# EAGLE design M715X (EAGLE 6.6.0)
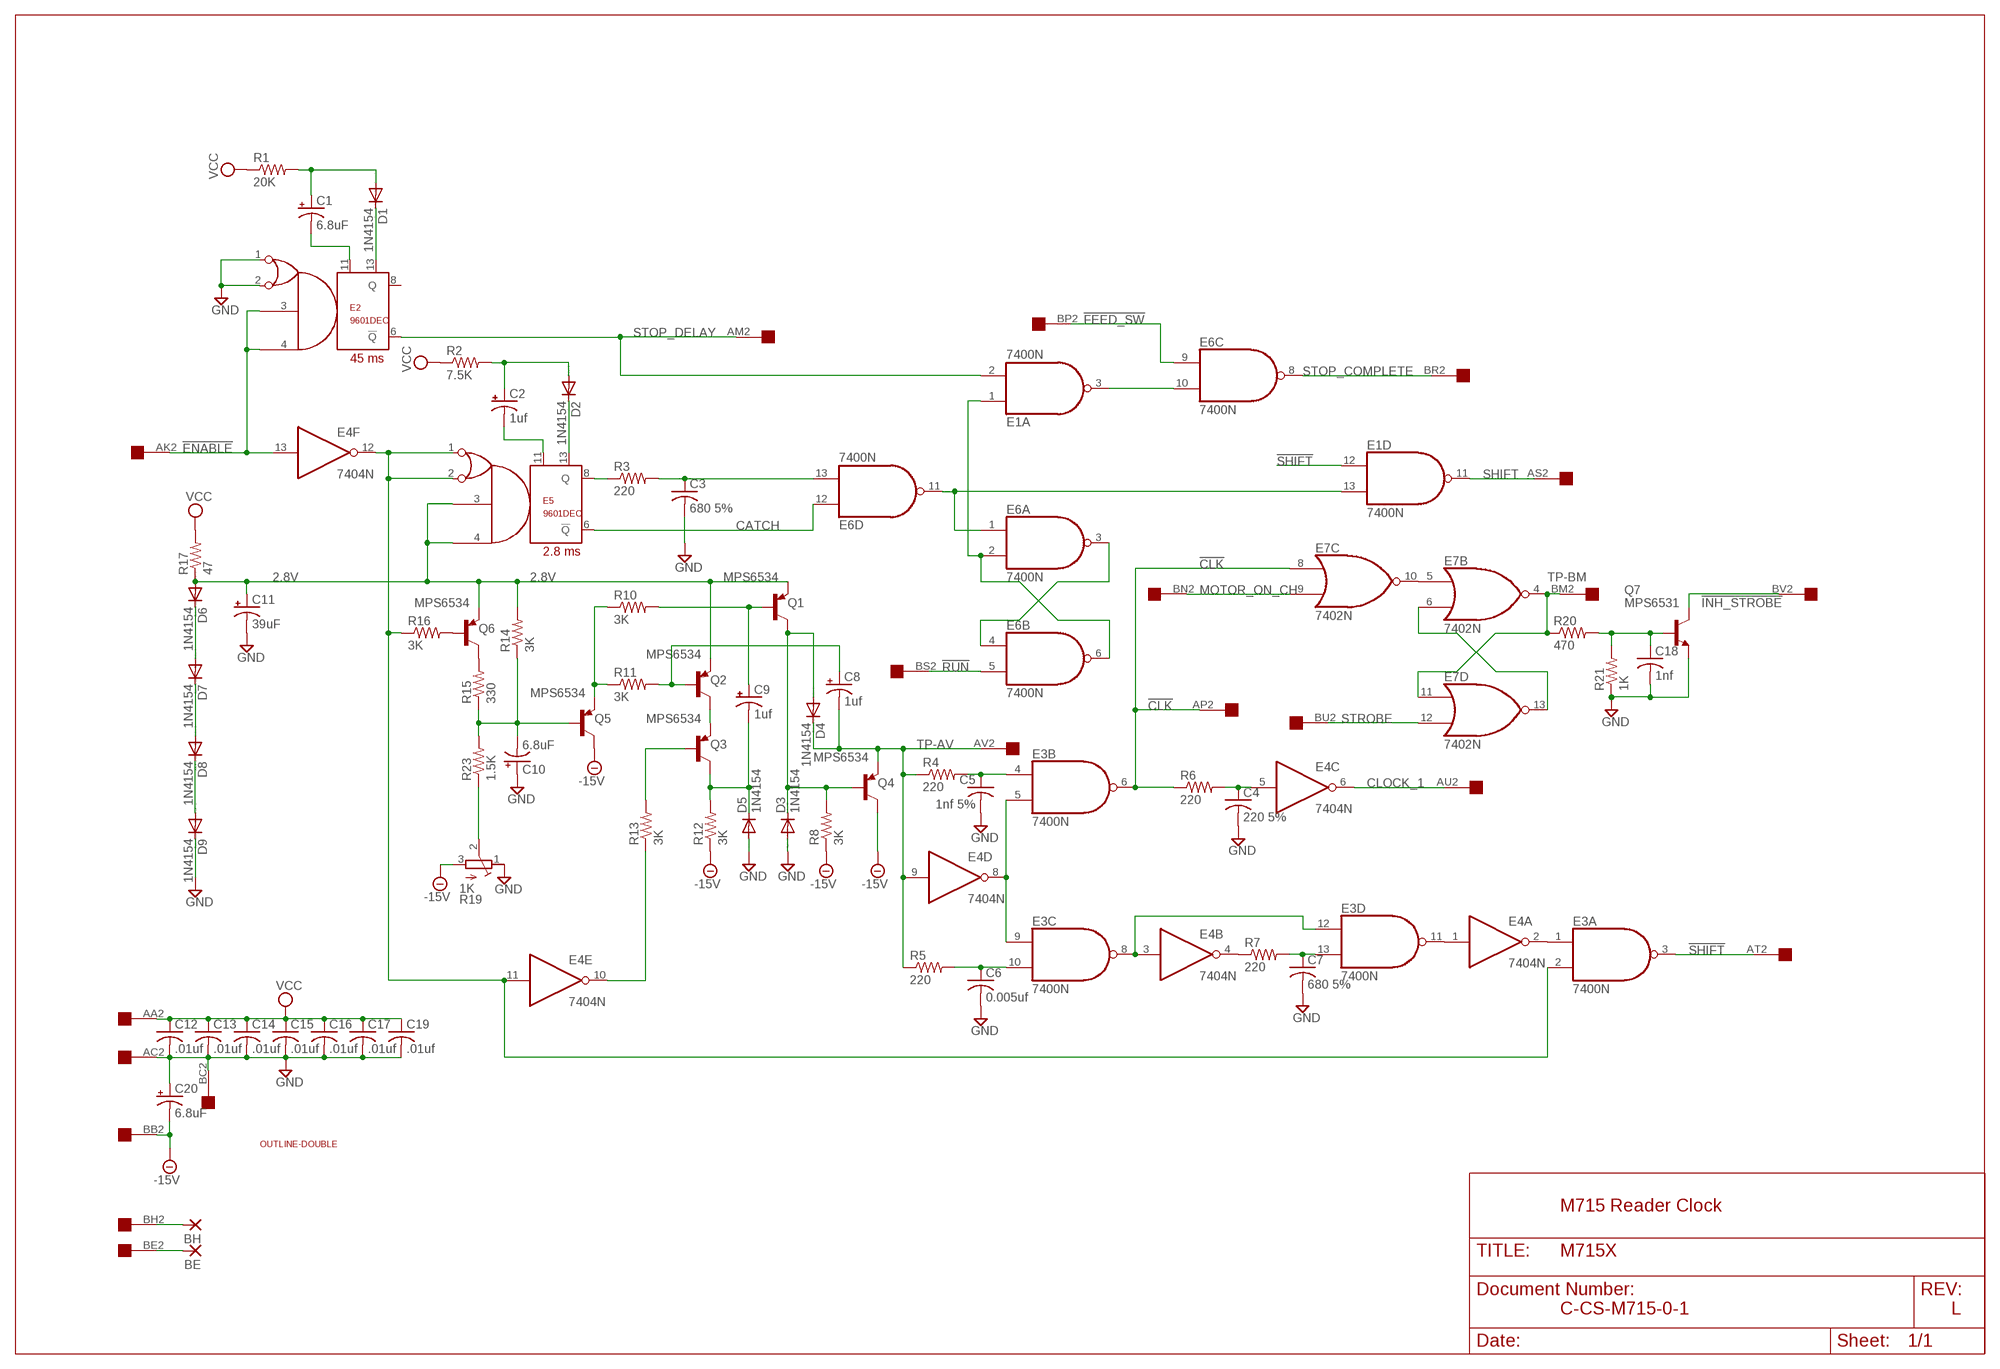
[diagram p0: schematic, sheet 1]

## Parts
BE  1,6/0,8  [1,6/0,8]
BH  1,6/0,8  [1,6/0,8]
C1  6.8uF  CPOL-USE20-8AXIAL  [E12-8]
C2  1uf  CPOL-USE15-5AXIAL  [E15-5]
C3  680 5%  C-US050-025X075  [C050-025X075]
C4  220 5%  C-US050-025X075  [C050-025X075]
C5  1nf 5%  C-US050-025X075  [C050-025X075]
C6  0.005uf  C-US050-025X075  [C050-025X075]
C7  680 5%  C-US050-025X075  [C050-025X075]
C8  1uf  CPOL-USE15-5AXIAL  [E15-5]
C9  1uf  CPOL-USE15-5AXIAL  [E15-5]
C10  6.8uF  CPOL-USE20-8AXIAL  [E12-8]
C11  39uF  CPOL-USE20-8AXIAL  [E12-8]
C12  .01uf  C-US050-025X075  [C050-025X075]
C13  .01uf  C-US050-025X075  [C050-025X075]
C14  .01uf  C-US050-025X075  [C050-025X075]
C15  .01uf  C-US050-025X075  [C050-025X075]
C16  .01uf  C-US050-025X075  [C050-025X075]
C17  .01uf  C-US050-025X075  [C050-025X075]
C18  1nf  C-US050-025X075  [C050-025X075]
C19  .01uf  C-US050-025X075  [C050-025X075]
C20  6.8uF  CPOL-USE20-8AXIAL  [E12-8]
D1  1N4154  1N4148DO35-10  [DO35-10]
D2  1N4154  1N4148DO35-10  [DO35-10]
D3  1N4154  1N4148DO35-10  [DO35-10]
D4  1N4154  1N4148DO35-10  [DO35-10]
D5  1N4154  1N4148DO35-10  [DO35-10]
D6  1N4154  1N4148DO35-10  [DO35-10]
D7  1N4154  1N4148DO35-10  [DO35-10]
D8  1N4154  1N4148DO35-10  [DO35-10]
D9  1N4154  1N4148DO35-10  [DO35-10]
E1  7400N  [DIL14]
E2  9601DEC  9601  [DIL14]
E3  7400N  [DIL14]
E4  7404N  [DIL14]
E5  9601DEC  9601  [DIL14]
E6  7400N  [DIL14]
E7  7402N  [DIL14]
Q1  MPS6534  -PNP-TO5  [TO5]
Q2  MPS6534  -PNP-TO5  [TO5]
Q3  MPS6534  -PNP-TO5  [TO5]
Q4  MPS6534  -PNP-TO5  [TO5]
Q5  MPS6534  -PNP-TO5  [TO5]
Q6  MPS6534  -PNP-TO5  [TO5]
Q7  MPS6531  -NPN-TO5  [TO5]
R1  20K  R-US_0207/10  [0207/10]
R2  7.5K  R-US_0207/10  [0207/10]
R3  220  R-US_0207/10  [0207/10]
R4  220  R-US_0207/10  [0207/10]
R5  220  R-US_0207/10  [0207/10]
R6  220  R-US_0207/10  [0207/10]
R7  220  R-US_0207/10  [0207/10]
R8  3K  R-US_0207/10  [0207/10]
R10  3K  R-US_0207/10  [0207/10]
R11  3K  R-US_0207/10  [0207/10]
R12  3K  R-US_0207/10  [0207/10]
R13  3K  R-US_0207/10  [0207/10]
R14  3K  R-US_0207/10  [0207/10]
R15  330  R-US_0207/10  [0207/10]
R16  3K  R-US_0207/10  [0207/10]
R17  47  R-US_0207/10  [0207/10]
R19  1K  275P  [3006Y]
R20  470  R-US_0207/10  [0207/10]
R21  1K  R-US_0207/10  [0207/10]
R23  1.5K  R-US_0207/10  [0207/10]
U$1  DOUBLE  [EDGE-CON4]
U$2  OUTLINE-DOUBLE  [DOUBLE]

## Nets
2.8V: C11.+ D6.A E5.3 E5.4 Q1.1(E) Q2.1(E) Q6.1(E) R14.2 R17.1
!CLK: E3.6(B:O) E7.8(C:I0) R6.1 U$1.AP2
!ENABLE: E2.3 E2.4 E4.13(F:I) U$1.AK2
!FEED_SW: E6.9(C:I0) U$1.BP2
!INH_STROBE: Q7.3(C) U$1.BV2
!RUN: E6.5(B:I1) U$1.BS2
!SHIFT: E1.12(D:I0) E3.3(A:O) U$1.AT2
-15V [Supply]: C20.- Q4.3(C) Q5.3(C) R8.1 R12.1 R19.3(E) U$1.BB2
BE: BE.1(P) U$1.BE2
BH: BH.1(P) U$1.BH2
CATCH: E5.6(!Q) E6.12(D:I0)
CLOCK_1: E4.6(C:O) U$1.AU2
GND [Supply]: C3.2 C4.2 C5.2 C6.2 C7.2 C10.+ C11.- C12.2 C13.2 C14.2 C15.2 C16.2 C17.2 C18.2 C19.2 C20.+ D3.A D5.A D9.C E2.1 E2.2 Q7.1(E) R19.1(A) R21.1 U$1.AC2 U$1.BC2
MOTOR_ON_CH: E7.9(C:I1) U$1.BN2
N$1: E6.3(A:O) E6.4(B:I0)
N$2: E1.1(A:I0) E6.2(A:I1) E6.6(B:O)
N$3: E1.13(D:I1) E6.1(A:I0) E6.11(D:O)
N$4: E3.1(A:I0) E4.2(A:O)
N$5: E7.6(B:I1) E7.13(D:O)
N$6: E1.3(A:O) E6.10(C:I1)
N$7: Q6.2(B) R16.2
N$8: E7.5(B:I0) E7.10(C:O)
N$9: E3.2(A:I1) E4.11(E:I) E4.12(F:O) E5.1 E5.2 R16.1
N$10: E3.5(B:I1) E3.9(C:I0) E4.8(D:O)
N$11: E3.11(D:O) E4.1(A:I)
N$12: E3.8(C:O) E3.12(D:I0) E4.3(B:I)
N$13: C7.1 E3.13(D:I1) R7.2
N$14: E4.4(B:O) R7.1
N$15: R19.2(S) R23.1
N$16: C4.1 E4.5(C:I) R6.2
N$17: C18.1 Q7.2(B) R20.2 R21.2
N$18: C6.1 E3.10(C:I1) R5.2
N$19: C5.1 E3.4(B:I0) R4.2
N$20: D6.C D7.A
N$21: D7.C D8.A
N$22: D8.C D9.A
N$23: Q6.3(C) R15.2
N$24: C10.- Q5.2(B) R14.1 R15.1 R23.2
N$26: Q5.1(E) R10.1 R11.1
N$27: Q2.3(C) Q3.1(E)
N$28: C8.+ Q2.2(B) R11.2
N$29: E4.10(E:O) R13.1
N$30: Q3.2(B) R13.2
N$31: C9.- D5.C Q3.3(C) R12.2
N$32: C9.+ Q1.2(B) R10.2
N$33: D3.C D4.A Q1.3(C) Q4.2(B) R8.2
N$35: D1.C E2.13
N$36: C1.- E2.11
N$37: C1.+ D1.A R1.2
N$38: D2.C E5.13
N$39: C2.- E5.11
N$40: C2.+ D2.A R2.2
N$42: E5.8(Q) R3.1
N$43: C3.1 E6.13(D:I1) R3.2
SHIFT: E1.11(D:O) U$1.AS2
STOP_COMPLETE: E6.8(C:O) U$1.BR2
STOP_DELAY: E1.2(A:I1) E2.6(!Q) U$1.AM2
STROBE: E7.12(D:I1) U$1.BU2
TP-AV: C8.- D4.C E4.9(D:I) Q4.1(E) R4.1 R5.1 U$1.AV2
TP-BM: E7.4(B:O) E7.11(D:I0) R20.1 U$1.BM2
VCC [Supply]: C12.1 C13.1 C14.1 C15.1 C16.1 C17.1 C19.1 R1.1 R2.1 R17.2 U$1.AA2
Unconnected: E1.4(B:I0) E1.5(B:I1) E1.6(B:O) E1.8(C:O) E1.9(C:I0) E1.10(C:I1) E2.8(Q) E7.1(A:O) E7.2(A:I0) E7.3(A:I1) U$1.AA1 U$1.AB1 U$1.AB2 U$1.AC1 U$1.AD1 U$1.AD2 U$1.AE1 U$1.AE2 U$1.AF1 U$1.AF2 U$1.AH1 U$1.AH2 U$1.AJ1 U$1.AJ2 U$1.AK1 U$1.AL1 U$1.AL2 U$1.AM1 U$1.AN1 U$1.AN2 U$1.AP1 U$1.AR1 U$1.AR2 U$1.AS1 U$1.AT1 U$1.AU1 U$1.AV1 U$1.BA1 U$1.BA2 U$1.BB1 U$1.BC1 U$1.BD1 U$1.BD2 U$1.BE1 U$1.BF1 U$1.BF2 U$1.BH1 U$1.BJ1 U$1.BJ2 U$1.BK1 U$1.BK2 U$1.BL1 U$1.BL2 U$1.BM1 U$1.BN1 U$1.BP1 U$1.BR1 U$1.BS1 U$1.BT1 U$1.BT2 U$1.BU1 U$1.BV1

## Notes on the sheet
- 45 ms
- 2.8 ms
- M715 Reader Clock
- C-CS-M715-0-1 | L

## Power pins joined to a net without a drawn wire
GND: E1.7(P:GND) E2.7(GND) E3.7(P:GND) E4.7(P:GND) E5.7(GND) E6.7(P:GND) E7.7(P:GND)
VCC: E1.14(P:VCC) E2.14(VCC) E3.14(P:VCC) E4.14(P:VCC) E5.14(VCC) E6.14(P:VCC) E7.14(P:VCC)

## Library data of the parts
BE BH = wirepad:1,6/0,8: THROUGH-HOLE PAD
C1 C10 C11 C20 = dec-con:CPOL-USE20-8AXIAL: A 0.8 inch electrolytic.
C2 C8 C9 = rcl:CPOL-US: POLARIZED CAPACITOR, American symbol
C3-C7 C12-C19 = rcl:C-US: CAPACITOR, American symbol
D1-D9 = diode:1N4148: DIODE high speed (Philips)
E1 E3 E6 = 74xx-us:74*00: Quad 2-input NAND gate
E2 E5 = dec-con:9601: DEC9601 monstable
E4 = 74xx-us:74*04: Hex INVERTER
E7 = 74xx-us:74*02: Quad 2-input NOR gate
Q1-Q6 = transistor:*-PNP-: PNP Transistror
Q7 = transistor:*-NPN-: NPN Transistror BF959 corrected 2008.03.06
R1-R8 R10-R17 R20 R21 R23 = rcl:R-US_: RESISTOR, American symbol
R19 = dec-con:275P: Trimpot with 275P (3006Y) footprint.
U$1 = dec-con:DOUBLE: Double-Height DEC board
U$2 = dec-con:OUTLINE-*: Board outlines for DEC boards.

## Net classes
1 Supply: width 0.813 mm

## Board
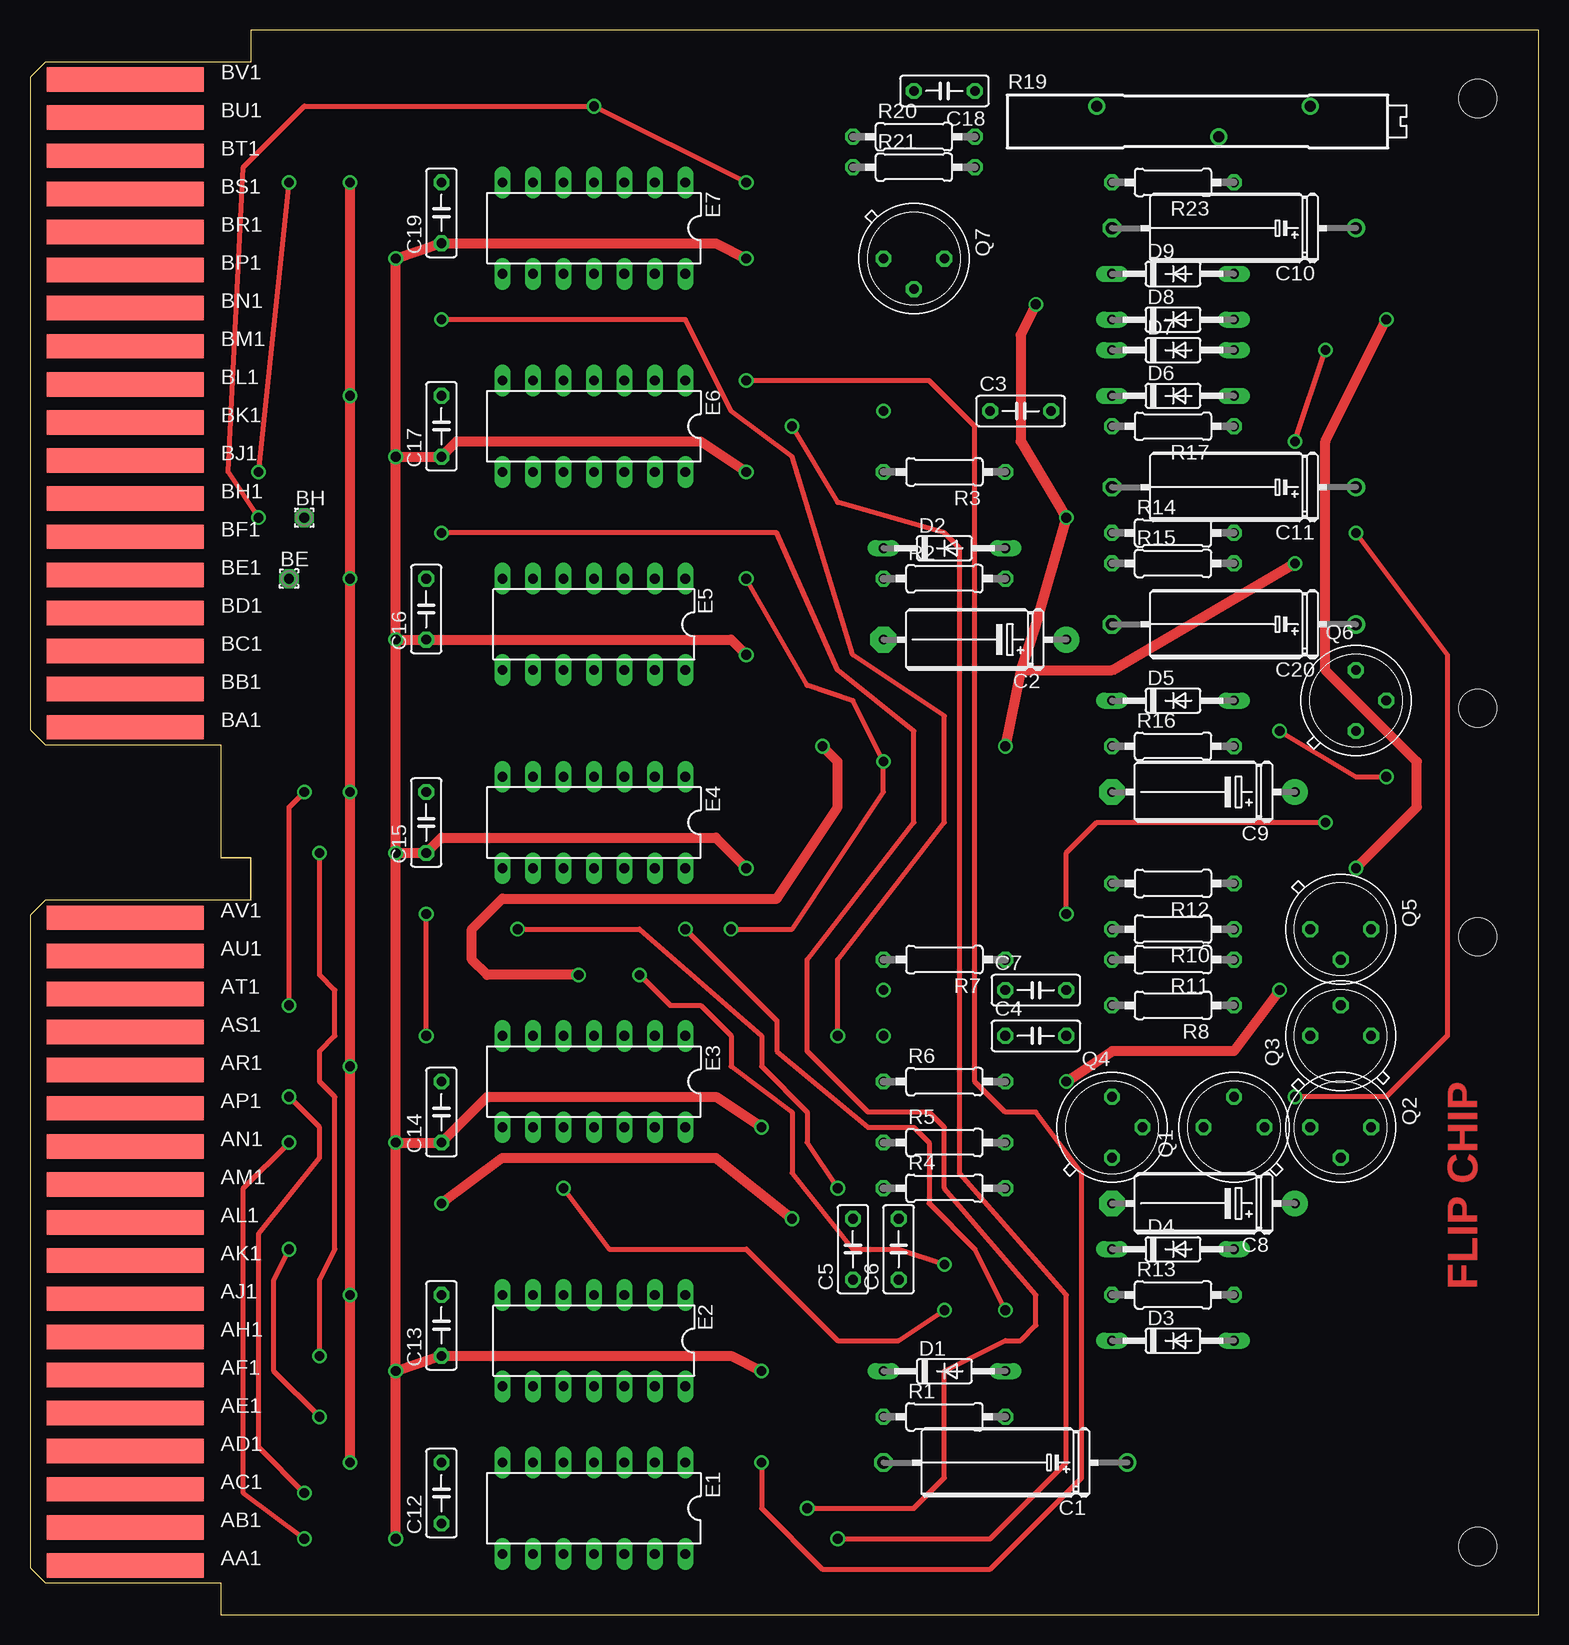
[diagram p1: board, top side]
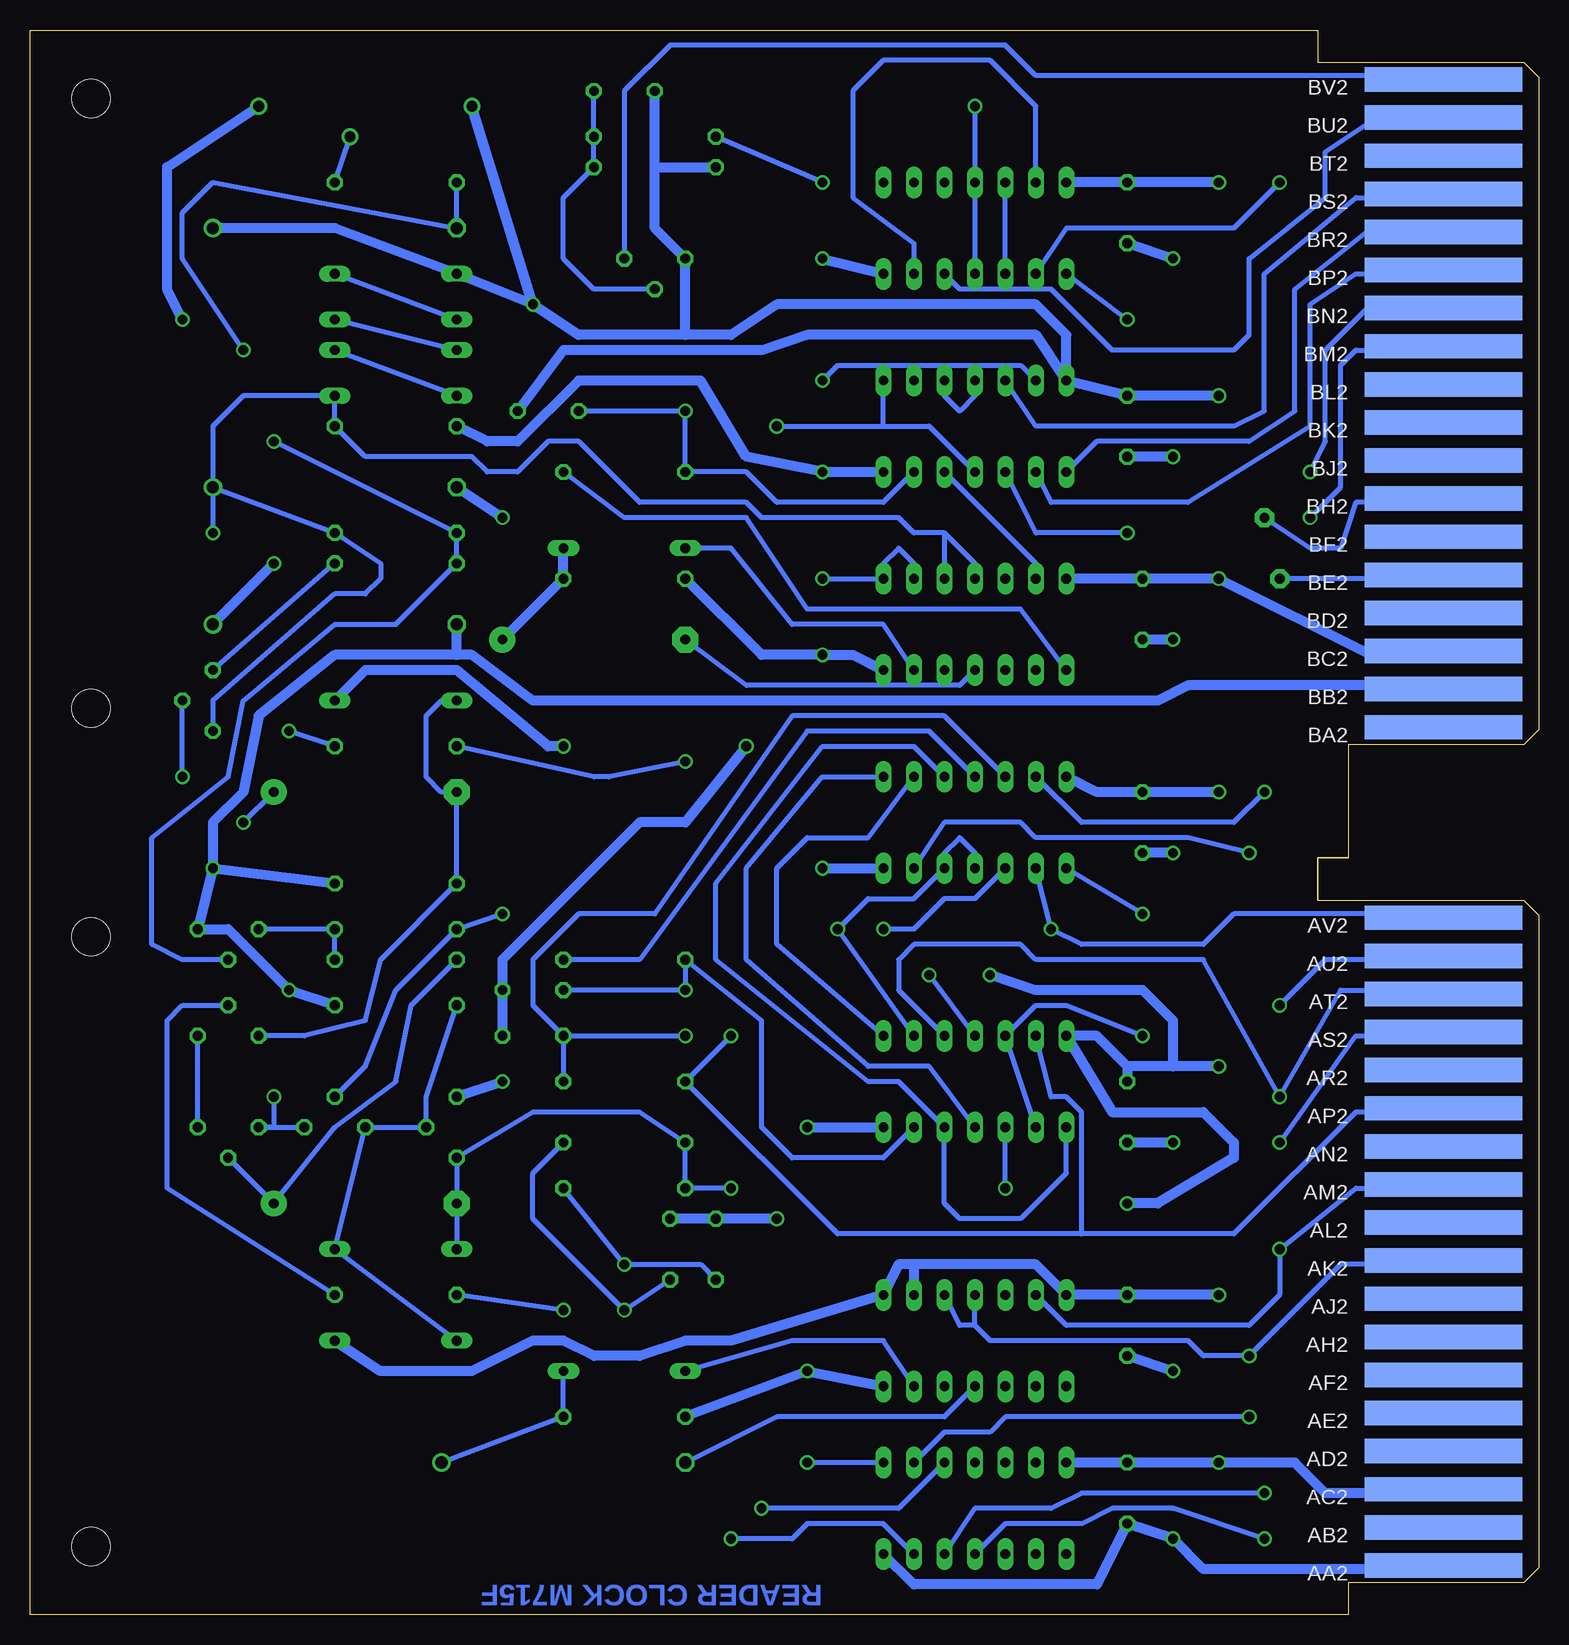
[diagram p2: board, bottom side, seen from below]

Size 125.73 x 132.08 mm. Coordinates in mm from the lower left corner, seen from the top.
Copper layers (1+16): Top 0.035mm / dielectric 1.5mm / Bottom 0.035mm
Design rules "16mils *": minimum track width 16mil, minimum drill 32mil, track to track 15mil, track to pad 10mil, pad to pad 10mil, via to via 10mil, smd to smd 10mil, copper to edge 13mil, drill to drill 10mil, minimum pad ring 10mil, minimum via ring 8mil, stop-mask expansion 0mil, vias tented up to drill 0mil, thermal gap 10mil

### Footprints (pad centres in the part's own frame; a part is rotated, then mirrored left to right if it is on the bottom)
1,6/0,8 = drill 0.813 pad 1.6 octagon: 1 0,0
E12-8 = drill 1.016: + -10.16,0 | drill 1.016 octagon: - 10.16,0
E15-5 = drill 0.813 pad 2.159: + -7.62,0 | drill 0.813 pad 2.159 octagon: - 7.62,0
C050-025X075 = drill 0.813 octagon: 1 -2.54,0; 2 2.54,0
DO35-10 = drill 0.813 long: A 5.08,0; C -5.08,0
DIL14 = drill 0.813 long: 1 -7.62,-3.81; 2 -5.08,-3.81; 3 -2.54,-3.81; 4 0,-3.81; 5 2.54,-3.81; 6 5.08,-3.81; 7 7.62,-3.81; 8 7.62,3.81; 9 5.08,3.81; 10 2.54,3.81; 11 0,3.81; 12 -2.54,3.81; 13 -5.08,3.81; 14 -7.62,3.81
TO5 = drill 0.813 octagon: 1 0,-2.54; 2 2.54,0; 3 0,2.54
0207/10 = drill 0.813 octagon: 1 -5.08,0; 2 5.08,0
3006Y = drill 0.9: 1 -8.89,1.27; 2 1.27,-1.27; 3 8.89,1.27
EDGE-CON4 = smd 13.106 x 2.032: AA1 7.938,4.128; AB1 7.938,7.303; AC1 7.938,10.477; AD1 7.938,13.652; AE1 7.938,16.828; AF1 7.938,20.003; AH1 7.938,23.177; AJ1 7.938,26.352; AK1 7.938,29.527; AL1 7.938,32.703; AM1 7.938,35.877; AN1 7.938,39.053; AP1 7.938,42.227; AR1 7.938,45.403; AS1 7.938,48.578; AT1 7.938,51.752; AU1 7.938,54.928; AV1 7.938,58.102; BA1 7.938,73.978; BB1 7.938,77.153; BC1 7.938,80.328; BD1 7.938,83.502; BE1 7.938,86.677; BF1 7.938,89.853; BH1 7.938,93.028; BJ1 7.938,96.203; BK1 7.938,99.377; BL1 7.938,102.552; BM1 7.938,105.728; BN1 7.938,108.903; BP1 7.938,112.078; BR1 7.938,115.252; BS1 7.938,118.427; BT1 7.938,121.603; BU1 7.938,124.778; BV1 7.938,127.953 | smd 13.106 x 2.032 bottom: AA2 7.938,4.128; AB2 7.938,7.303; AC2 7.938,10.477; AD2 7.938,13.652; AE2 7.938,16.828; AF2 7.938,20.003; AH2 7.938,23.177; AJ2 7.938,26.352; AK2 7.938,29.527; AL2 7.938,32.703; AM2 7.938,35.877; AN2 7.938,39.053; AP2 7.938,42.227; AR2 7.938,45.403; AS2 7.938,48.578; AT2 7.938,51.752; AU2 7.938,54.928; AV2 7.938,58.102; BA2 7.938,73.978; BB2 7.938,77.153; BC2 7.938,80.328; BD2 7.938,83.502; BE2 7.938,86.677; BF2 7.938,89.853; BH2 7.938,93.028; BJ2 7.938,96.203; BK2 7.938,99.377; BL2 7.938,102.552; BM2 7.938,105.728; BN2 7.938,108.903; BP2 7.938,112.078; BR2 7.938,115.252; BS2 7.938,118.427; BT2 7.938,121.603; BU2 7.938,124.778; BV2 7.938,127.953
DOUBLE = hole 3.175: 120.65,56.515; 120.65,5.715; 120.65,75.565; 120.65,126.365

### Placement (x,y rotation side)
BE  21.59,86.36 0 top
BH  22.86,91.44 0 top
C1  81.28,12.7 180 top
C2  78.74,81.28 180 top
C3  82.55,100.33 0 top
C4  83.82,48.26 0 top
C5  68.58,30.48 90 top
C6  72.39,30.48 90 top
C7  83.82,52.07 0 top
C8  97.79,34.29 180 top
C9  97.79,68.58 180 top
C10  100.33,115.57 180 top
C11  100.33,93.98 180 top
C12  34.29,10.16 90 top
C13  34.29,24.13 90 top
C14  34.29,41.91 90 top
C15  33.02,66.04 90 top
C16  33.02,83.82 90 top
C17  34.29,99.06 90 top
C18  76.2,127 180 top
C19  34.29,116.84 90 top
C20  100.33,82.55 180 top
D1  76.2,20.32 0 top
D2  76.2,88.9 0 top
D3  95.25,22.86 0 top
D4  95.25,30.48 0 top
D5  95.25,76.2 0 top
D6  95.25,101.6 0 top
D7  95.25,105.41 0 top
D8  95.25,107.95 0 top
D9  95.25,111.76 0 top
E1  46.99,8.89 180 top
E2  46.99,22.86 180 top
E3  46.99,44.45 180 top
E4  46.99,66.04 180 top
E5  46.99,82.55 180 top
E6  46.99,99.06 180 top
E7  46.99,115.57 180 top
Q1  100.33,40.64 90 top
Q2  109.22,40.64 270 top
Q3  109.22,48.26 90 top
Q4  90.17,40.64 0 top
Q5  109.22,57.15 270 top
Q6  110.49,76.2 0 top
Q7  73.66,113.03 270 top
R1  76.2,16.51 0 top
R2  76.2,86.36 0 top
R3  76.2,95.25 180 top
R4  76.2,35.56 0 top
R5  76.2,39.37 0 top
R6  76.2,44.45 0 top
R7  76.2,54.61 180 top
R8  95.25,50.8 180 top
R10  95.25,57.15 180 top
R11  95.25,54.61 180 top
R12  95.25,60.96 180 top
R13  95.25,26.67 0 top
R14  95.25,90.17 0 top
R15  95.25,87.63 0 top
R16  95.25,72.39 0 top
R17  95.25,99.06 180 top
R19  97.79,124.46 0 top
R20  73.66,123.19 0 top
R21  73.66,120.65 0 top
R23  95.25,119.38 180 top
U$1  0,0 0 top
U$2  0,0 0 top
U$4  [FLIPCHIP]  123.19,63.5 180 top

### Tracks (layer width: path | path; a pad name or v marks a point on that pad's centre or on a via)
2.8V  (via drill 0.81 pad 0.25)
  Top 0.406: v105.41,43.18 113.03,43.18 118.11,48.26 118.11,80.01 v110.49,90.17
  Bottom 0.406: E5.4 46.99,87.63 49.53,90.17 | 49.53,90.17 E5.3 | 49.53,90.17 52.07,90.17 53.34,91.44 64.77,91.44 66.04,92.71 74.93,92.71 80.01,97.79 82.55,97.79 85.09,95.25 87.63,95.25 88.9,96.52 97.79,96.52 R17.1 D6.A 107.95,101.6 110.49,99.06 C11.+ | C11.+ R14.2 96.52,87.63 96.52,86.36 97.79,85.09 100.33,85.09 110.49,76.2 Q6.1 | C11.+ v110.49,90.17 | Q1.1 Q2.1 105.41,40.64 v105.41,43.18
!CLK  (via drill 0.81 pad 0.25)
  Top 0.406: v67.31,48.26 67.31,54.61 76.2,66.04 76.2,74.93 68.58,80.01 63.5,96.52 58.42,100.33 54.61,107.95 v34.29,107.95
  Bottom 0.406: U$1.AP2 8.89,41.91 15.24,41.91 25.4,31.75 38.1,31.75 | 38.1,31.75 38.1,41.91 39.37,43.18 40.64,43.18 E3.6 | 38.1,31.75 58.42,31.75 R6.1 v67.31,48.26 | v34.29,107.95 E7.8
!ENABLE  (via drill 0.81 pad 0.25)
  Top 0.406: v24.13,21.59 24.13,27.94 25.4,30.48 25.4,43.18 24.13,44.45 24.13,46.99 25.4,48.26 25.4,52.07 24.13,53.34 v24.13,63.5
  Bottom 0.406: E4.13 49.53,66.04 43.18,66.04 41.91,64.77 29.21,64.77 v24.13,63.5 | U$1.AK2 8.89,29.21 16.51,29.21 v24.13,21.59 27.94,21.59 29.21,22.86 45.72,22.86 46.99,24.13 | 46.99,24.13 E2.4 | E2.3 48.26,24.13 46.99,24.13
!FEED_SW
  Bottom 0.406: E6.9 40.64,92.71 29.21,92.71 19.05,99.06 19.05,109.22 15.24,111.76 8.89,111.76 U$1.BP2
!INH_STROBE
  Bottom 0.406: U$1.BV2 8.26,128.27 41.91,128.27 44.45,130.81 72.39,130.81 76.2,127 Q7.3
!RUN
  Bottom 0.406: U$1.BS2 8.89,118.11 15.24,118.11 22.86,111.76 22.86,100.33 25.4,99.06 41.91,99.06 E6.5
!SHIFT  (via drill 0.81 pad 0.25)
  Top 0.406: v22.86,10.16 19.05,13.97 19.05,31.75 24.13,38.1 24.13,40.64 v21.59,43.18
  Bottom 0.406: U$1.AT2 8.89,52.07 16.51,52.07 v21.59,43.18 27.94,54.61 41.91,54.61 43.18,55.88 52.07,55.88 53.34,54.61 53.34,52.07 E3.3 | E1.12 46.99,8.89 40.64,8.89 38.1,10.16 v22.86,10.16
-15V  (via drill 0.81 pad 0.25)
  Top 0.813: v104.14,52.07 100.33,46.99 90.17,46.99 v86.36,44.45 | v113.03,107.95 107.95,97.79 107.95,78.74 115.57,71.12 115.57,67.31 v110.49,62.23
  Bottom 0.813: U$1.BB2 8.89,77.47 29.21,77.47 31.75,76.2 83.82,76.2 88.9,80.01 90.17,80.01 | R19.3 114.3,120.65 114.3,110.49 v113.03,107.95 | v86.36,44.45 Q4.3 | v110.49,62.23 R12.1 | v110.49,62.23 Q5.3 109.22,57.15 v104.14,52.07 R8.1 | 90.17,80.01 100.33,80.01 106.68,74.93 107.95,68.58 110.49,66.04 v110.49,62.23 | 90.17,80.01 C20.-
BE
  Bottom 0.406: U$1.BE2 8.89,86.36 BE.1
BH
  Bottom 0.406: U$1.BH2 8.89,92.71 15.24,92.71 16.51,88.9 19.05,88.9 BH.1
CATCH
  Bottom 0.406: E5.6 41.91,87.63 E6.12
CLOCK_1  (via drill 0.81 pad 0.25)
  Top 0.406: v21.59,50.8 21.59,67.31 v22.86,68.58
  Bottom 0.406: E4.6 38.1,66.04 25.4,66.04 v22.86,68.58 | U$1.AU2 8.89,54.61 17.78,54.61 v21.59,50.8
GND  (via drill 0.81, 0.81 pad 0.25)
  Top 0.813: v26.67,12.7 v26.67,26.67 v26.67,45.72 v26.67,68.58 v26.67,86.36 v26.67,101.6 v26.67,119.38 | v34.29,34.29 39.37,38.1 57.15,38.1 v63.5,33.02 | v66.04,72.39 67.31,71.12 67.31,67.31 62.23,59.69 39.37,59.69 36.83,57.15 36.83,54.61 38.1,53.34 v45.72,53.34 | v83.82,109.22 82.55,106.68 82.55,97.79 v86.36,91.44 83.82,82.55 82.55,78.74 | 82.55,78.74 v81.28,72.39 | v105.41,87.63 90.17,78.74 82.55,78.74 | 82.55,78.74 82.85,78.67
  Bottom 0.813: E7.7 C19.2 v26.67,119.38 | 73.66,120.65 73.66,115.57 Q7.1 71.12,106.68 | 73.66,120.65 C18.2 | 73.66,120.65 R21.1 | v83.82,109.22 R19.1 | v83.82,109.22 D9.C 100.33,115.57 C10.+ | v83.82,109.22 80.01,106.68 71.12,106.68 | 71.12,106.68 67.31,106.68 63.5,109.22 41.91,109.22 39.37,106.68 E6.7 | E6.7 41.91,106.68 60.96,106.68 64.77,105.41 81.28,105.41 C3.2 | v26.67,101.6 C17.2 E6.7 | U$1.BC2 8.89,80.01 13.97,80.01 v26.67,86.36 C16.2 E5.7 | v86.36,91.44 C11.- | E4.7 36.83,68.58 C15.2 v26.67,68.58 | U$1.AC2 8.89,10.16 17.78,10.16 20.32,12.7 v26.67,12.7 C12.2 E1.7 | v26.67,26.67 C13.2 E2.7 41.91,29.21 52.07,29.21 | 52.07,29.21 53.34,29.21 E2.1 67.31,22.86 71.12,22.86 74.93,21.59 78.74,21.59 81.28,22.86 83.82,22.86 88.9,20.32 96.52,20.32 D3.A | 52.07,29.21 E2.2 | 34.29,45.72 36.83,48.26 E3.7 35.56,41.91 27.94,41.91 25.4,39.37 25.4,38.1 31.75,34.29 v34.29,34.29 | 34.29,45.72 C14.2 | 30.48,45.72 34.29,45.72 | v26.67,45.72 30.48,45.72 | 30.48,45.72 30.48,49.53 33.02,52.07 41.91,52.07 v45.72,53.34 | C4.2 C7.2 86.36,54.61 74.93,66.04 71.12,66.04 v66.04,72.39 | v63.5,33.02 C5.2 C6.2 | D5.A 97.79,78.74 90.17,78.74 82.55,72.39 v81.28,72.39 | v105.41,87.63 C20.+
MOTOR_ON_CH  (via drill 0.81, 0.81 pad 0.25)
  Top 0.406: v19.05,95.25 v21.59,119.38
  Bottom 0.406: E7.9 39.37,115.57 25.4,115.57 v21.59,119.38 | U$1.BN2 8.89,109.22 13.97,109.22 17.78,105.41 17.78,97.79 v19.05,95.25
N$1
  Bottom 0.406: E6.4 46.99,101.6 48.26,100.33 49.53,101.6 E6.3
N$2  (via drill 0.81, 0.81 pad 0.25)
  Top 0.406: v60.96,12.7 60.96,8.89 66.04,3.81 80.01,3.81 87.63,11.43 87.63,36.83 83.82,41.91 81.28,41.91 78.74,44.45 78.74,99.06 74.93,102.87 v59.69,102.87
  Bottom 0.406: E6.6 43.18,104.14 52.07,104.14 | 52.07,104.14 58.42,104.14 v59.69,102.87 | 52.07,104.14 E6.2 | E1.1 v60.96,12.7
N$3  (via drill 0.81, 0.81 pad 0.25)
  Top 0.406: v67.31,6.35 80.01,6.35 86.36,12.7 86.36,26.67 77.47,36.83 77.47,88.9 76.2,90.17 67.31,92.71 v63.5,99.06
  Bottom 0.406: E6.11 50.8,99.06 54.61,99.06 | 54.61,99.06 E6.1 | v63.5,99.06 54.61,99.06 | E1.13 54.61,7.62 60.96,7.62 62.23,6.35 v67.31,6.35
N$4
  Bottom 0.406: E4.2 55.88,64.77 60.96,64.77 63.5,62.23 63.5,55.88 E3.1
N$5
  Bottom 0.406: E7.6 41.91,125.73 45.72,129.54 54.61,129.54 57.15,127 57.15,118.11 52.07,114.3 E7.13
N$6  (via drill 0.81, 0.81 pad 0.25)
  Top 0.406: v64.77,8.89 73.66,8.89 76.2,11.43 76.2,20.32 81.28,22.86 82.55,22.86 83.82,24.13 83.82,26.67 76.2,35.56 76.2,40.64 74.93,41.91 69.85,41.91 64.77,46.99 64.77,54.61 73.66,66.04 73.66,73.66 67.31,78.74 62.23,90.17 v34.29,90.17
  Bottom 0.406: E6.10 41.91,90.17 v34.29,90.17 | E1.3 53.34,8.89 v64.77,8.89
N$7  (via drill 0.81 pad 0.25)
  Top 0.406: v104.14,73.66 110.49,69.85 v113.03,69.85
  Bottom 0.406: v113.03,69.85 Q6.2 | R16.2 v104.14,73.66
N$8
  Bottom 0.406: E7.10 E7.5
N$9  (via drill 0.81 pad 0.25)
  Top 0.406: v59.69,86.36 64.77,77.47 68.58,76.2 v71.12,71.12 71.12,68.58 63.5,57.15 v58.42,57.15
  Bottom 0.406: E5.2 52.07,87.63 53.34,88.9 54.61,87.63 E5.1 v59.69,86.36 | E3.2 v58.42,57.15 55.88,59.69 52.07,59.69 E4.12 49.53,63.5 48.26,64.77 46.99,63.5 E4.11 | R16.1 78.74,69.85 77.47,69.85 v71.12,71.12
N$10  (via drill 0.81 pad 0.25)
  Top 0.406: v33.02,48.26 v33.02,58.42
  Bottom 0.406: v33.02,58.42 E4.8 | E3.9 E3.5 41.91,50.8 39.37,50.8 v33.02,48.26
N$11
  Bottom 0.406: E4.1 59.69,69.85 66.04,62.23 66.04,54.61 55.88,45.72 50.8,45.72 E3.11
N$12
  Bottom 0.406: E4.3 52.07,72.39 59.69,72.39 68.58,60.96 68.58,54.61 55.88,44.45 53.34,44.45 E3.12 49.53,34.29 48.26,33.02 43.18,33.02 39.37,36.83 E3.8
N$13  (via drill 0.81 pad 0.25)
  Bottom 0.406: E3.13 54.61,38.1 62.23,38.1 64.77,40.64 64.77,49.53 R7.2 v71.12,52.07 C7.1
N$14
  Bottom 0.406: E4.4 50.8,73.66 60.96,73.66 74.93,54.61 R7.1
N$15
  Bottom 0.406: R23.1 R19.2
N$16  (via drill 0.81 pad 0.25)
  Bottom 0.406: E4.5 49.53,74.93 62.23,74.93 73.66,58.42 80.01,58.42 83.82,54.61 83.82,50.8 C4.1 | C4.1 v71.12,48.26 | C4.1 R6.2
N$17
  Bottom 0.406: Q7.2 78.74,110.49 81.28,113.03 81.28,118.11 R21.2 R20.2 C18.1
N$18  (via drill 0.81 pad 0.25)
  Top 0.406: v44.45,35.56 48.26,30.48 59.69,30.48 67.31,22.86 72.39,22.86 v76.2,25.4
  Bottom 0.406: v44.45,35.56 E3.10 | C6.1 v76.2,25.4 83.82,33.02 83.82,36.83 R5.2
N$19  (via drill 0.81 pad 0.25)
  Top 0.406: v50.8,53.34 53.34,50.8 55.88,50.8 58.42,48.26 58.42,45.72 63.5,41.91 63.5,36.83 68.58,30.48 72.39,30.48 v76.2,29.21
  Bottom 0.406: E3.4 v50.8,53.34 | C5.1 69.85,29.21 v76.2,29.21 R4.2
N$20
  Bottom 0.406: D6.C D7.A
N$21
  Bottom 0.406: D7.C D8.A
N$22
  Bottom 0.406: D8.C D9.A
N$23
  Bottom 0.406: R15.2 Q6.3
N$24  (via drill 0.81 pad 0.25)
  Top 0.406: v105.41,97.79 v107.95,105.41
  Bottom 0.406: R23.2 C10.- 110.49,119.38 113.03,116.84 113.03,113.03 v107.95,105.41 | v105.41,97.79 R14.1 R15.1 95.25,82.55 100.33,82.55 107.95,76.2 109.22,69.85 115.57,64.77 115.57,55.88 113.03,54.61 Q5.2
N$26
  Bottom 0.406: R11.1 R10.1 Q5.1
N$27
  Bottom 0.406: Q2.3 Q3.1
N$28
  Bottom 0.406: R11.2 93.98,50.8 95.25,44.45 100.33,40.64 C8.+ Q2.2
N$29  (via drill 0.81 pad 0.25)
  Top 0.406: v54.61,57.15 62.23,49.53 62.23,46.99 69.85,40.64 73.66,40.64 74.93,39.37 74.93,34.29 78.74,30.48 v81.28,25.4
  Bottom 0.406: E4.10 46.99,59.69 49.53,59.69 52.07,57.15 v54.61,57.15 | v81.28,25.4 R13.1
N$30
  Bottom 0.406: R13.2 114.3,35.56 114.3,49.53 113.03,50.8 Q3.2
N$31
  Bottom 0.406: Q3.3 102.87,48.26 97.79,49.53 96.52,54.61 R12.2 C9.- 91.44,68.58 92.71,69.85 92.71,74.93 91.44,76.2 D5.C
N$32  (via drill 0.81 pad 0.25)
  Top 0.406: v107.95,66.04 88.9,66.04 86.36,63.5 v86.36,58.42
  Bottom 0.406: Q1.2 97.79,45.72 95.25,52.07 R10.2 v86.36,58.42 | v107.95,66.04 C9.+
N$33
  Bottom 0.406: R8.2 92.71,43.18 Q4.2 Q1.3 D4.A D3.C
N$35
  Bottom 0.406: E2.13 54.61,22.86 62.23,22.86 D1.C
N$36
  Bottom 0.406: E2.11 49.53,16.51 63.5,16.51 C1.-
N$37
  Bottom 0.406: D1.A R1.2 C1.+
N$38
  Bottom 0.406: E5.13 54.61,82.55 62.23,82.55 67.31,88.9 D2.C
N$39
  Bottom 0.406: E5.11 48.26,77.47 66.04,77.47 C2.-
N$40
  Bottom 0.813: D2.A R2.2 C2.+
N$42
  Bottom 0.406: E5.8 43.18,83.82 60.96,83.82 66.04,91.44 76.2,91.44 R3.1
N$43  (via drill 0.81 pad 0.25)
  Bottom 0.406: E6.13 54.61,92.71 63.5,92.71 66.04,95.25 R3.2 v71.12,100.33 C3.1
SHIFT  (via drill 0.81 pad 0.25)
  Top 0.406: v21.59,39.37 17.78,35.56 17.78,10.16 v22.86,6.35
  Bottom 0.406: U$1.AS2 8.89,48.26 15.24,48.26 v21.59,39.37 | E1.11 44.45,7.62 38.1,7.62 35.56,8.89 30.48,8.89 v22.86,6.35
STOP_COMPLETE
  Bottom 0.406: U$1.BR2 8.89,115.57 13.97,115.57 20.32,110.49 20.32,100.33 24.13,97.79 36.83,97.79 E6.8
STOP_DELAY  (via drill 0.81 pad 0.25)
  Top 0.406: v24.13,16.51 20.32,20.32 20.32,27.94 v21.59,30.48
  Bottom 0.406: E1.2 49.53,15.24 45.72,15.24 44.45,16.51 v24.13,16.51 | E2.6 39.37,24.13 24.13,24.13 21.59,26.67 v21.59,30.48 15.24,35.56 8.89,35.56 U$1.AM2
STROBE
  Bottom 0.406: E7.12 48.26,110.49 40.64,110.49 35.56,105.41 25.4,105.41 24.13,106.68 24.13,113.03 17.78,118.11 17.78,121.92 13.97,124.46 8.89,124.46 U$1.BU2
TP-AV  (via drill 0.81 pad 0.25)
  Top 0.406: v40.64,57.15 50.8,57.15 60.96,48.26 60.96,45.72 64.77,41.91 64.77,39.37 v67.31,35.56
  Bottom 0.406: E4.9 v40.64,57.15 38.1,55.88 27.94,55.88 25.4,58.42 8.89,58.42 U$1.AV2 | v67.31,35.56 R4.1 R5.1 74.93,41.91 83.82,41.91 Q4.1 C8.- D4.C
TP-BM  (via drill 0.81, 0.81 pad 0.25)
  Top 0.406: v59.69,119.38 v46.99,125.73 22.86,125.73 17.78,120.65 16.51,95.25 v19.05,91.44
  Bottom 0.406: E7.11 E7.4 v46.99,125.73 | v59.69,119.38 R20.1 | U$1.BM2 8.89,105.41 15.24,105.41 16.51,104.14 16.51,93.98 v19.05,91.44
VCC  (via drill 0.81, 0.81 pad 0.25)
  Top 0.813: v30.48,6.35 v30.48,20.32 | v30.48,81.28 v30.48,96.52 | v30.48,96.52 v30.48,113.03 C19.1 57.15,114.3 v59.69,113.03 | v30.48,39.37 v30.48,63.5 | v30.48,63.5 v30.48,81.28 | v30.48,20.32 v30.48,39.37 | v59.69,95.25 55.88,97.79 35.56,97.79 C17.1 v30.48,96.52 | v59.69,80.01 58.42,81.28 C16.1 v30.48,81.28 | v59.69,62.23 57.15,64.77 34.29,64.77 C15.1 v30.48,63.5 | v60.96,20.32 58.42,21.59 C13.1 v30.48,20.32 | v60.96,40.64 57.15,43.18 38.1,43.18 C14.1 v30.48,39.37
  Bottom 0.813: v59.69,113.03 E7.14 | v30.48,96.52 C17.1 | v30.48,81.28 C16.1 | E5.14 57.15,80.01 v59.69,80.01 64.77,80.01 R2.1 | E6.14 v59.69,95.25 66.04,96.52 69.85,102.87 80.01,102.87 85.09,97.79 87.63,97.79 R17.2 | v59.69,62.23 E4.14 | v30.48,63.5 C15.1 | U$1.AA2 8.89,3.81 27.94,3.81 v30.48,6.35 C12.1 36.83,2.54 52.07,2.54 E1.14 | E2.14 v60.96,20.32 R1.1 | v30.48,20.32 C13.1 | v60.96,40.64 E3.14 | v30.48,39.37 C14.1 | v30.48,113.03 C19.1

### Text on the board
Bottom: READER CLOCK M715F